# EAGLE schematic LockBox (EAGLE 7.1.0)
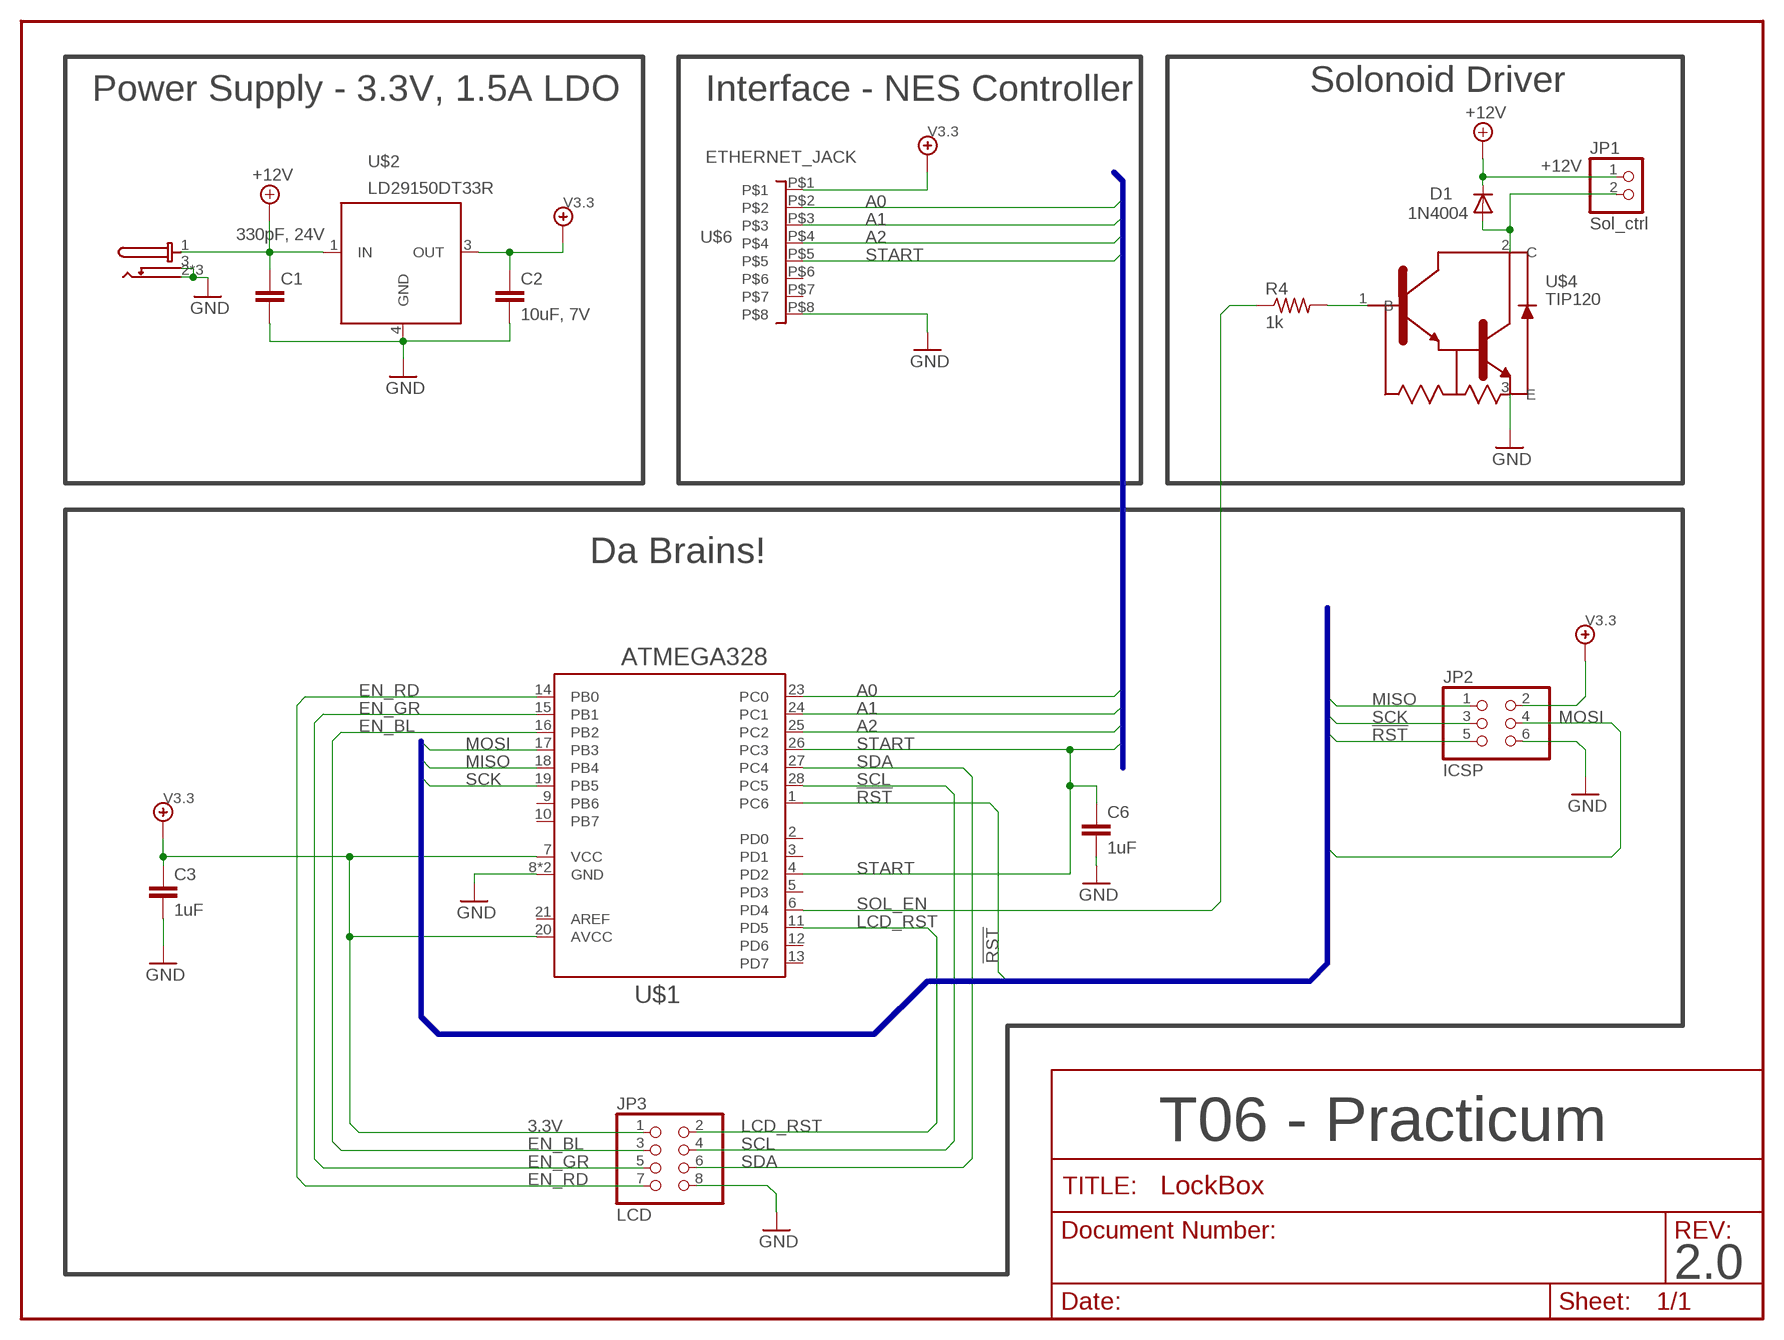
[diagram p0: schematic, sheet 1]

## Parts
C1  330pF, 24V  C  [C0805]
C2  10uF, 7V  C  [C0805]
C3  1uF  C  [C0805]
C6  1uF  C  [C0805]
D1  1N4004  [DO41-10]
JP1  Sol_ctrl  PINHD-1X2  [1X02]
JP2  ICSP  PINHD-2X3  [2X03]
JP3  LCD  PINHD-2X4  [2X04]
R4  1k  R-US_M0805  [M0805]
U$1  ATMEGA328  [DIL28-3]
U$2  LD29150DT33R  [DPAK]
U$3  PJ_075DH  [PWR_JACK]
U$4  TIP120  [T0220-3]
U$6  ETHERNET_JACK  [MODJACK8]

## Nets
3.3V: C2.1 C3.1 JP3.1 U$1.7(VCC) U$1.20(AVCC) U$2.3(OUT) U$6.P$1 ; supply symbol labelled V3.3
!RST: JP2.5 U$1.1(PC6)
+12V: C1.1 D1.C JP1.1 U$2.1(IN) U$3.1(PWR)
A0: U$1.23(PC0) U$6.P$2
A1: U$1.24(PC1) U$6.P$3
A2: U$1.25(PC2) U$6.P$4
EN_BL: JP3.3 U$1.16(PB2)
EN_GR: JP3.5 U$1.15(PB1)
EN_RD: JP3.7 U$1.14(PB0)
GND: C1.2 C2.2 C3.2 C6.2 JP2.6 JP3.8 U$1.8(GND) U$1.22(GND) U$2.4(GND) U$3.2(GND) U$3.3(GND) U$3.P$1(GND) U$3.P$5(GND) U$4.3(E) U$6.P$8
LCD_RST: JP3.2 U$1.11(PD5)
MISO: JP2.1 U$1.18(PB4)
MOSI: JP2.4 U$1.17(PB3)
N$1: R4.2 U$4.1(B)
N$5: D1.A JP1.2 U$4.2(C)
P$1: JP2.2 ; supply symbol labelled V3.3
SCK: JP2.3 U$1.19(PB5)
SCL: JP3.4 U$1.28(PC5)
SDA: JP3.6 U$1.27(PC4)
SOL_EN: R4.1 U$1.6(PD4)
START: C6.1 U$1.4(PD2) U$1.26(PC3) U$6.P$5
Unconnected: U$1.2(PD0) U$1.3(PD1) U$1.5(PD3) U$1.9(PB6) U$1.10(PB7) U$1.12(PD6) U$1.13(PD7) U$6.P$6 U$6.P$7

## Buses
NES_ENCODER_BUS:A0,A1,A2,START
ICSP_BUS:MISO,MOSI,!RST,SCK

## Notes on the sheet
- Power Supply - 3.3V, 1.5A LDO | Interface - NES Controller | Solonoid Driver
- Da Brains!
- T06 - Practicum
- 2.0

## Power pins joined to a net without a drawn wire
AREF: U$1.21(AREF)

## Library data of the parts
C1-C3 C6 = LockBox:C: CAPACITOR, European symbol; SPICEMODEL: NONE; SPICEPREFIX: C
D1 = LockBox:1N4004: DIODE general purpose rectifier, 1 A
JP1 = LockBox:PINHD-1X2: PIN HEADER
JP2 = LockBox:PINHD-2X3: PIN HEADER
JP3 = LockBox:PINHD-2X4: PIN HEADER
R4 = LockBox:R-US_: RESISTOR, American symbol
U$1 = LockBox:ATMEGA328: Atmel 8-bit Microcontroller source: http://www.atmel.com/images/atmel-8271-8-bit-avr-microcontroller-atmega48a-48pa-88a-88pa-168a-168pa-328-328p_datasheet_summary.pdf; DIGIKEY: http://www.digikey.com/product-detail/en/ATMEGA328-PU/ATMEGA328-PU-ND/2271026; PB0: GPIO; PB1: GPIO; PB2: GPIO; PB3: MOSI; PB4: MISO; PB5: SCK; PC4: SDA; PC5: SCL; PC6: RESET; PD2: INT0; PD4: GPIO; PD5: GPIO
U$2 = LockBox:LD29150: LD29150 - 1.5A, Very low drop voltage regulator High current, high accuracey, low-dropout voltage regulator Source: http://www.st.com/web/en/resource/technical/document/datasheet/CD00003403.pdf; DIGIKEY: 497-3468-1-ND; VOUT: 3.3V
U$3 = LockBox:PJ_075: DC Power Jack Low profile, surface mount, internal switch Source: http://www.cui.com/product/resource/pj-075ch-smt.pdf; CURRENT: 3.5A; PINDIAMETER: 1.3mm; VOLTAGE: 16V
U$4 = LockBox:TIP120: TIP120 - NPN Epitaxial Darlington Transistor Medium Power Linear Switch Source: https://www.fairchildsemi.com/datasheets/TI/TIP122.pdf; DIGIKEY: TIP120TUFS-ND; MFG: Fairchild
U$6 = LockBox:ETHERNET_JACK: 8-Pin eithernet jack